# Altium schematic sheet MCU.SchDoc
size A3; Address1: Address1; Address2: Address2; Address3: Address3; Address4: Address4
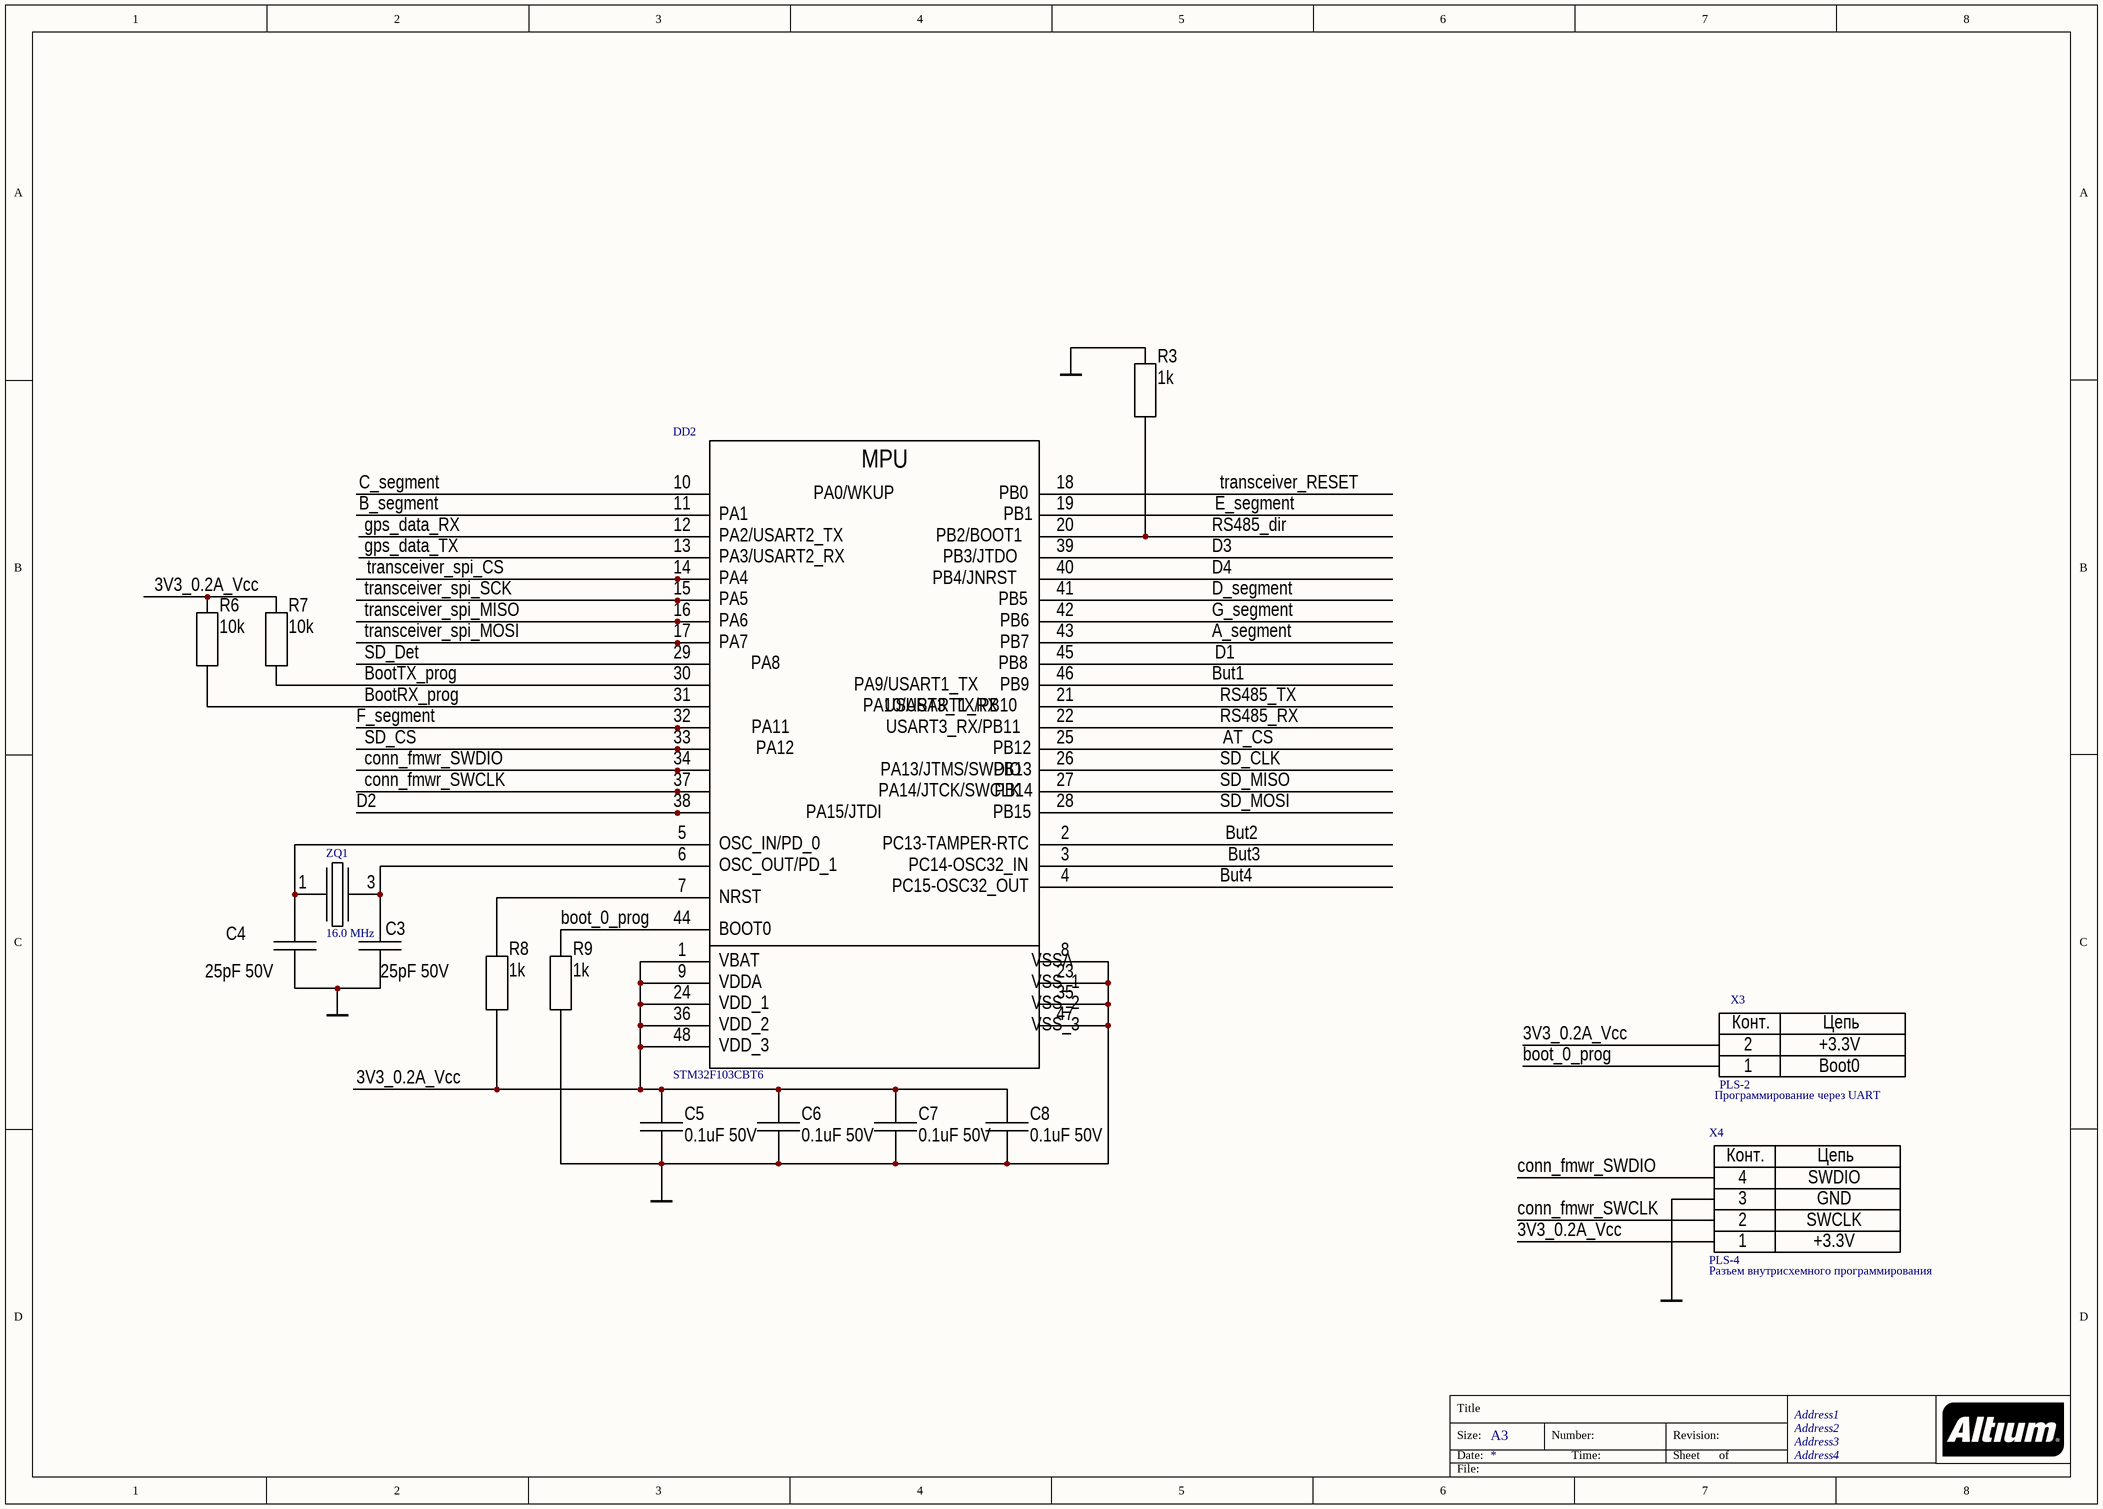
[diagram p0: MCU.SchDoc]

## Parts
C3  25pF 50V  [0805_CAP]
C4  25pF 50V  [0805_CAP]
C5  0.1uF 50V  [0805_CAP]
C6  0.1uF 50V  [0805_CAP]
C7  0.1uF 50V  [0805_CAP]
C8  0.1uF 50V  [0805_CAP]
DD2  STM32F103CBT6  [Lqfp-48]
R3  1k  [0805_RES]
R6  10k  [0805_RES]
R7  10k  [0805_RES]
R8  1k  [0805_RES]
R9  1k  [0805_RES]
X3  PLS-2  Destiny: Программирование через UART  [PLS-2-2.54]
X4  PLS-4  Destiny: Разъем внутрисхемного программирования  [PLS-4-2.54]
ZQ1  16.0 MHz  [HC-49]

## Nets
GND: C3.1 C4.1 C5.1 C6.1 C7.1 C8.1 DD2.8 DD2.23 DD2.35 DD2.47 R3.2 R9.1 X4.3
3V3_0.2A_Vcc: C5.2 C6.2 C7.2 C8.2 DD2.1 DD2.9 DD2.24 DD2.36 DD2.48 R6.2 R7.2 R8.1 X3.2 X4.1
A_segment: DD2.43
AT_CS: DD2.25
B_segment: DD2.11
boot_0_prog: DD2.44 R9.2 X3.1
BootRX_prog: DD2.31 R6.1
BootTX_prog: DD2.30 R7.1
But1: DD2.46
But2: DD2.2
But3: DD2.3
But4: DD2.4
C_segment: DD2.10
conn_fmwr_SWCLK: DD2.37 X4.2
conn_fmwr_SWDIO: DD2.34 X4.4
D1: DD2.45
D2: DD2.38
D3: DD2.39
D4: DD2.40
D_segment: DD2.41
E_segment: DD2.19
F_segment: DD2.32
G_segment: DD2.42
gps_data_RX: DD2.12
gps_data_TX: DD2.13
RS485_dir: DD2.20 R3.1
RS485_RX: DD2.22
RS485_TX: DD2.21
SD_CLK: DD2.26
SD_CS: DD2.33
SD_Det: DD2.29
SD_MISO: DD2.27
SD_MOSI: DD2.28
transceiver_RESET: DD2.18
transceiver_spi_CS: DD2.14
transceiver_spi_MISO: DD2.16
transceiver_spi_MOSI: DD2.17
transceiver_spi_SCK: DD2.15
NetC3_2: C3.2 DD2.6 ZQ1.3
NetC4_2: C4.2 DD2.5 ZQ1.1
NetDD2_7: DD2.7 R8.2

## Notes on the sheet
- Title
- Size:
- Date:
- A3
- Number:
- Time:
- Revision:
- Sheet
- of
- File:
- (in symbol 2pin_conn) Конт.; Цепь
- (in symbol 4pin_conn) Конт.; Цепь
- (in symbol STM32F103-48) MPU; PA0/WKUP; PB0; PA1; PB1; PA2/USART2_TX; PB2/BOOT1; PA3/USART2_RX; PB3/JTDO; PA4; PB4/JNRST; PA5; PB5; PA6; PB6; PA7; PB7; PA8; PB8; PA9/USART1_TX; PB9; PA10/USART1_RX; USART3_TX/PB10; PA11; USART3_RX/PB11; PA12; PB12; PA13/JTMS/SWDIO; PB13; PA14/JTCK/SWCLK; PB14; PA15/JTDI; PB15; OSC_IN/PD_0; PC13-TAMPER-RTC; OSC_OUT/PD_1; PC14-OSC32_IN; PC15-OSC32_OUT; NRST; BOOT0; VBAT; VSSA; VDDA; VSS_1; VDD_1; VSS_2; VDD_2; VSS_3; VDD_3

## Library data of the parts
C3-C8 = Cap_np
  C3 C4: Value: 25pF 50V
  C5-C8: Value: 0.1uF 50V
DD2 = STM32F103-48: Value: STM32F103CBT6
R3 R6-R9 = Res
  R3 R8 R9: Value: 1k
  R6 R7: Value: 10k
X3 = 2pin_conn: PinName2: +3.3V; PinName1: Boot0; Value: PLS-2
X4 = 4pin_conn: PinName1: +3.3V; PinName2: SWCLK; PinName3: GND; PinName4: SWDIO; Value: PLS-4
ZQ1 = Cristall: Value: 16.0 MHz